# EAGLE schematic ui_board (EAGLE 6.5.0)
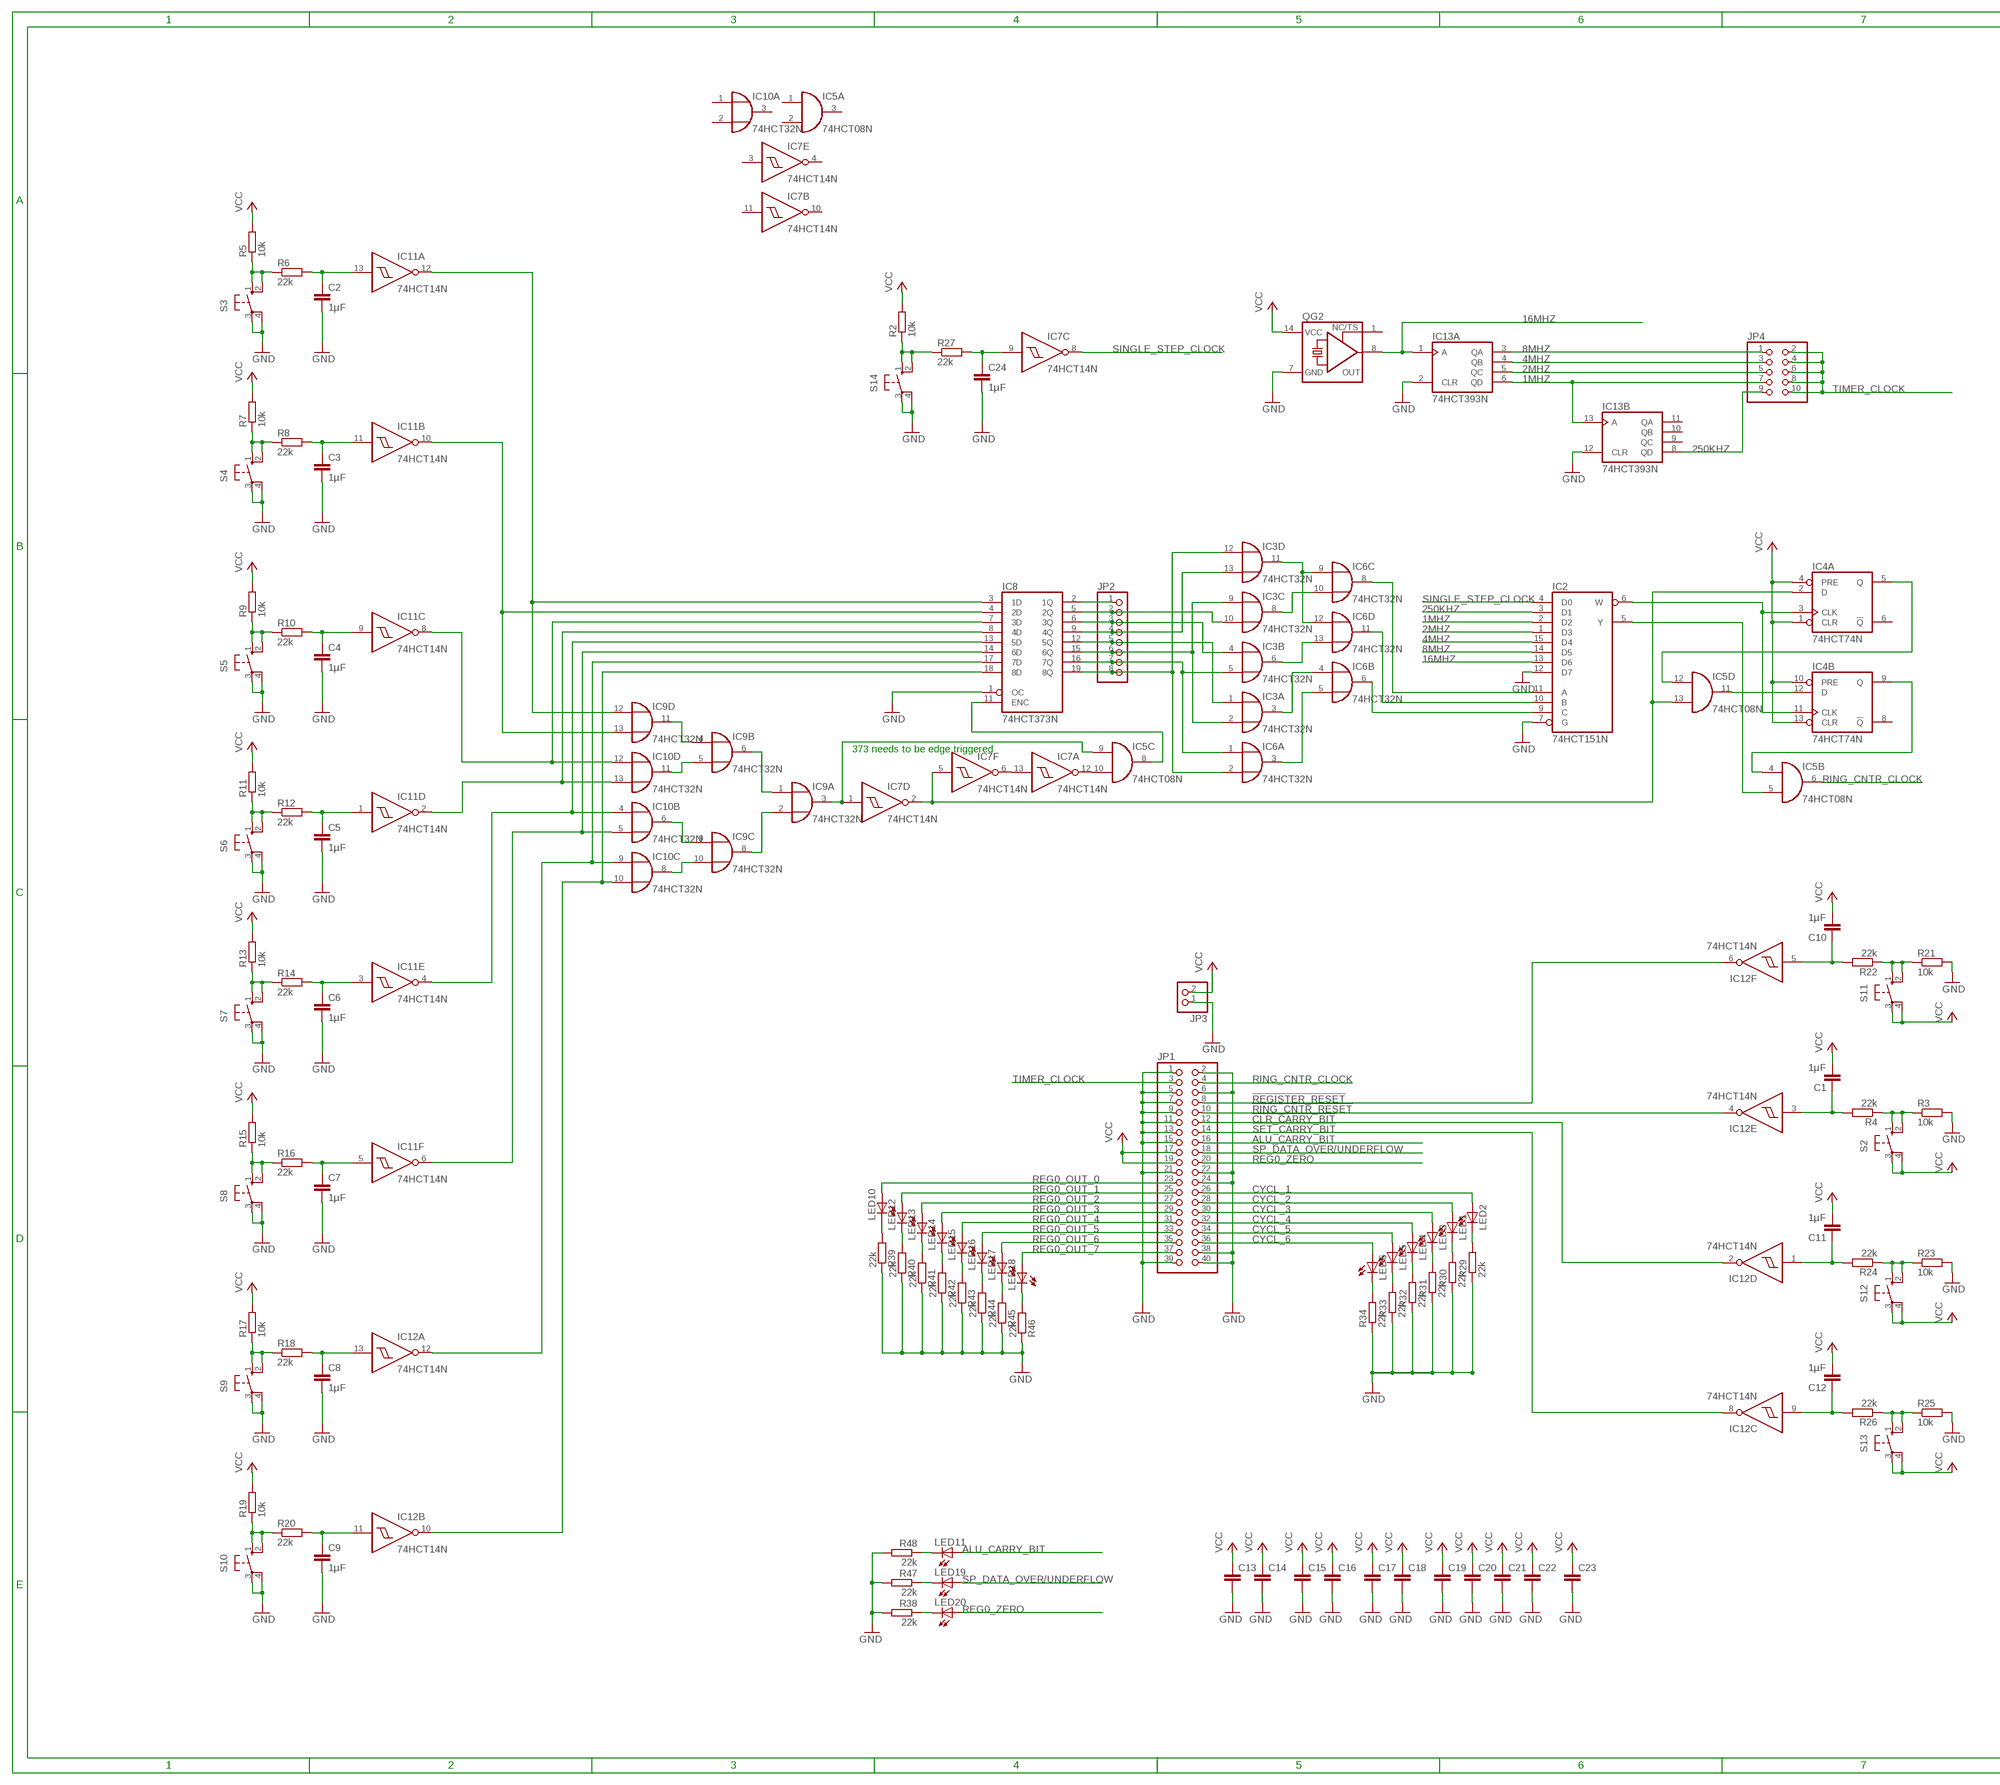
[diagram p0: schematic, sheet 1, part 1 of 2]
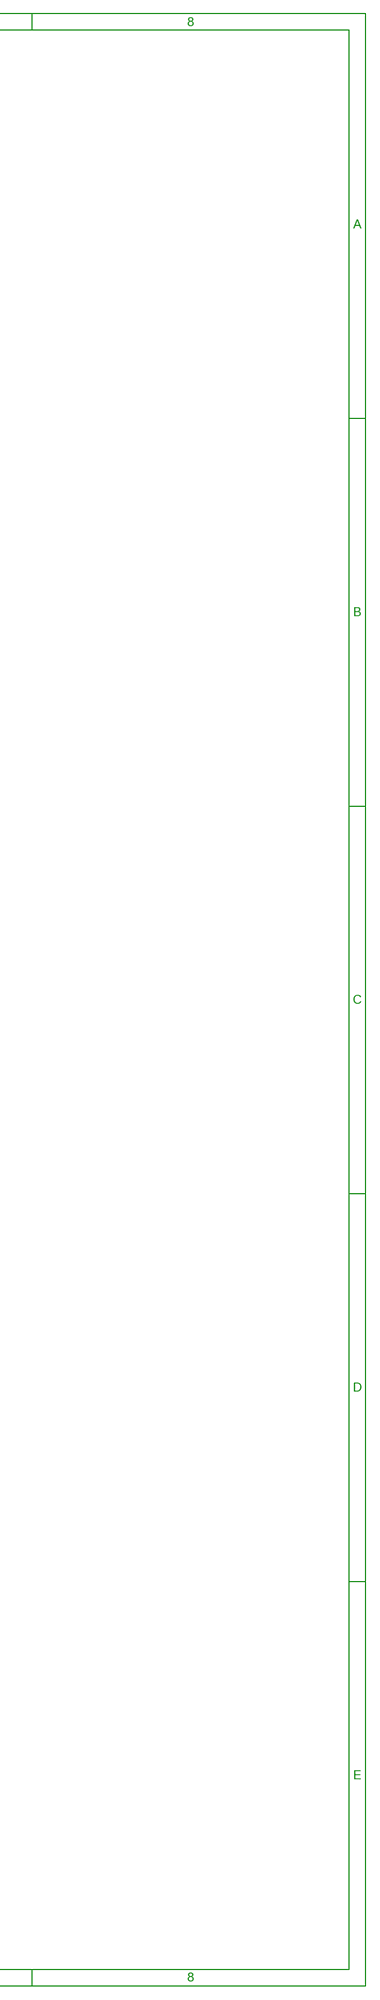
[diagram p1: schematic, sheet 1, part 2 of 2]

## Parts
C1  1µF  C-EU025-024X044  [C025-024X044]
C2  1µF  C-EU025-024X044  [C025-024X044]
C3  1µF  C-EU025-024X044  [C025-024X044]
C4  1µF  C-EU025-024X044  [C025-024X044]
C5  1µF  C-EU025-024X044  [C025-024X044]
C6  1µF  C-EU025-024X044  [C025-024X044]
C7  1µF  C-EU025-024X044  [C025-024X044]
C8  1µF  C-EU025-024X044  [C025-024X044]
C9  1µF  C-EU025-024X044  [C025-024X044]
C10  1µF  C-EU025-024X044  [C025-024X044]
C11  1µF  C-EU025-024X044  [C025-024X044]
C12  1µF  C-EU025-024X044  [C025-024X044]
C13  C-EUC1206  [C1206]
C14  C-EUC1206  [C1206]
C15  C-EUC1206  [C1206]
C16  C-EUC1206  [C1206]
C17  C-EUC1206  [C1206]
C18  C-EUC1206  [C1206]
C19  C-EUC1206  [C1206]
C20  C-EUC1206  [C1206]
C21  C-EUC1206  [C1206]
C22  C-EUC1206  [C1206]
C23  C-EUC1206  [C1206]
C24  1µF  C-EU025-024X044  [C025-024X044]
IC2  74HCT151N  [DIL16]
IC3  74HCT32N  [DIL14]
IC4  74HCT74N  [DIL14]
IC5  74HCT08N  [DIL14]
IC6  74HCT32N  [DIL14]
IC7  74HCT14N  [DIL14]
IC8  74HCT373N  [DIL20]
IC9  74HCT32N  [DIL14]
IC10  74HCT32N  [DIL14]
IC11  74HCT14N  [DIL14]
IC12  74HCT14N  [DIL14]
IC13  74HCT393N  [DIL14]
JP1  PINHD-2X20  [2X20]
JP2  PINHD-1X8  [1X08]
JP3  PINHD-1X2  [1X02]
JP4  PINHD-2X5  [2X05]
LED1  LED3MM  [LED3MM]
LED2  LED3MM  [LED3MM]
LED3  LED3MM  [LED3MM]
LED4  LED3MM  [LED3MM]
LED5  LED3MM  [LED3MM]
LED6  LED3MM  [LED3MM]
LED10  LED3MM  [LED3MM]
LED11  LED3MM  [LED3MM]
LED12  LED3MM  [LED3MM]
LED13  LED3MM  [LED3MM]
LED14  LED3MM  [LED3MM]
LED15  LED3MM  [LED3MM]
LED16  LED3MM  [LED3MM]
LED17  LED3MM  [LED3MM]
LED18  LED3MM  [LED3MM]
LED19  LED3MM  [LED3MM]
LED20  LED3MM  [LED3MM]
QG2  XO-14  [DIL14S]
R2  10k  R-EU_R1206  [R1206]
R3  10k  R-EU_R1206  [R1206]
R4  22k  R-EU_R1206  [R1206]
R5  10k  R-EU_R1206  [R1206]
R6  22k  R-EU_R1206  [R1206]
R7  10k  R-EU_R1206  [R1206]
R8  22k  R-EU_R1206  [R1206]
R9  10k  R-EU_R1206  [R1206]
R10  22k  R-EU_R1206  [R1206]
R11  10k  R-EU_R1206  [R1206]
R12  22k  R-EU_R1206  [R1206]
R13  10k  R-EU_R1206  [R1206]
R14  22k  R-EU_R1206  [R1206]
R15  10k  R-EU_R1206  [R1206]
R16  22k  R-EU_R1206  [R1206]
R17  10k  R-EU_R1206  [R1206]
R18  22k  R-EU_R1206  [R1206]
R19  10k  R-EU_R1206  [R1206]
R20  22k  R-EU_R1206  [R1206]
R21  10k  R-EU_R1206  [R1206]
R22  22k  R-EU_R1206  [R1206]
R23  10k  R-EU_R1206  [R1206]
R24  22k  R-EU_R1206  [R1206]
R25  10k  R-EU_R1206  [R1206]
R26  22k  R-EU_R1206  [R1206]
R27  22k  R-EU_R1206  [R1206]
R29  22k  R-EU_R1206  [R1206]
R30  22k  R-EU_R1206  [R1206]
R31  22k  R-EU_R1206  [R1206]
R32  22k  R-EU_R1206  [R1206]
R33  22k  R-EU_R1206  [R1206]
R34  22k  R-EU_R1206  [R1206]
R38  22k  R-EU_R1206  [R1206]
R39  22k  R-EU_R1206  [R1206]
R40  22k  R-EU_R1206  [R1206]
R41  22k  R-EU_R1206  [R1206]
R42  22k  R-EU_R1206  [R1206]
R43  22k  R-EU_R1206  [R1206]
R44  22k  R-EU_R1206  [R1206]
R45  22k  R-EU_R1206  [R1206]
R46  22k  R-EU_R1206  [R1206]
R47  22k  R-EU_R1206  [R1206]
R48  22k  R-EU_R1206  [R1206]
S2  10-XX  [B3F-10XX]
S3  10-XX  [B3F-10XX]
S4  10-XX  [B3F-10XX]
S5  10-XX  [B3F-10XX]
S6  10-XX  [B3F-10XX]
S7  10-XX  [B3F-10XX]
S8  10-XX  [B3F-10XX]
S9  10-XX  [B3F-10XX]
S10  10-XX  [B3F-10XX]
S11  10-XX  [B3F-10XX]
S12  10-XX  [B3F-10XX]
S13  10-XX  [B3F-10XX]
S14  10-XX  [B3F-10XX]

## Nets
1MHZ: IC2.2(D2) IC13.6(A:QD) IC13.13(B:A) JP4.7
2MHZ: IC2.1(D3) IC13.5(A:QC) JP4.5
4MHZ: IC2.15(D4) IC13.4(A:QB) JP4.3
8MHZ: IC2.14(D5) IC13.3(A:QA) JP4.1
16MHZ: IC2.13(D6) IC13.1(A:A) QG2.8(OUT)
250KHZ: IC2.3(D1) IC13.8(B:QD) JP4.9
!CLR_CARRY_BIT: IC12.2(D:O) JP1.12
!REGISTER_RESET: IC12.6(F:O) JP1.8
!RING_CNTR_RESET: IC12.4(E:O) JP1.10
!SET_CARRY_BIT: IC12.8(C:O) JP1.14
ALU_CARRY_BIT: JP1.16 LED11.A
CHANGE_CLOCK_SELECT: IC5.9(C:I0) IC7.1(D:I) IC9.3(A:O)
CHANGE_CLOCK_SELECT1: IC8.3(1D) IC9.12(D:I0) IC11.12(A:O)
CHANGE_CLOCK_SELECT2: IC8.4(2D) IC9.13(D:I1) IC11.10(B:O)
CHANGE_CLOCK_SELECT3: IC8.7(3D) IC10.12(D:I0) IC11.8(C:O)
CHANGE_CLOCK_SELECT5: IC8.13(5D) IC10.4(B:I0) IC11.4(E:O)
CHANGE_CLOCK_SELECT6: IC8.14(6D) IC10.5(B:I1) IC11.6(F:O)
CHANGE_CLOCK_SELECT7: IC8.17(7D) IC10.9(C:I0) IC12.12(A:O)
CHANGE_CLOCK_SELECT8: IC8.18(8D) IC10.10(C:I1) IC12.10(B:O)
CYCL_1: JP1.26 LED2.A
CYCL_2: JP1.28 LED1.A
CYCL_3: JP1.30 LED3.A
CYCL_4: JP1.32 LED4.A
CYCL_5: JP1.34 LED5.A
CYCL_6: JP1.36 LED6.A
GND: C2.2 C3.2 C4.2 C5.2 C6.2 C7.2 C8.2 C9.2 C13.2 C14.2 C15.2 C16.2 C17.2 C18.2 C19.2 C20.2 C21.2 C22.2 C23.2 C24.2 IC2.7(G) IC2.12(D7) IC8.1(OC) IC13.2(A:CLR) IC13.12(B:CLR) JP1.1 JP1.2 JP1.5 JP1.6 JP1.7 JP1.9 JP1.11 JP1.13 JP1.15 JP1.21 JP1.22 JP1.24 JP1.38 JP1.39 JP1.40 JP3.1 QG2.7(GND) R3.2 R21.2 R23.2 R25.2 R29.1 R30.1 R31.1 R32.1 R33.1 R34.1 R38.2 R39.1 R40.1 R41.1 R42.1 R43.1 R44.1 R45.1 R46.1 R47.2 R48.2 S3.3(P) S3.4(P1) S4.3(P) S4.4(P1) S5.3(P) S5.4(P1) S6.3(P) S6.4(P1) S7.3(P) S7.4(P1) S8.3(P) S8.4(P1) S9.3(P) S9.4(P1) S10.3(P) S10.4(P1) S14.3(P) S14.4(P1)
N$1: IC4.9(B:Q) IC5.4(B:I0)
N$3: R2.1 R27.1 S14.1(S) S14.2(S1)
N$4: IC4.12(B:D) IC5.11(D:O)
N$5: IC2.6(W) IC4.3(A:CLK) IC4.11(B:CLK)
N$6: IC2.10(B) IC6.11(D:O)
N$7: IC8.2(1Q) JP2.1
N$8: IC4.5(A:Q) IC5.12(D:I0)
N$9: IC7.6(F:O) IC7.13(A:I)
N$10: IC4.2(A:D) IC5.13(D:I1) IC7.2(D:O) IC7.5(F:I)
N$11: IC2.11(A) IC6.8(C:O)
N$12: IC3.11(D:O) IC6.9(C:I0) IC6.12(D:I0)
N$13: IC2.9(C) IC6.6(B:O)
N$14: R5.1 R6.1 S3.1(S) S3.2(S1)
N$15: C2.1 IC11.13(A:I) R6.2
N$16: R7.1 R8.1 S4.1(S) S4.2(S1)
N$17: LED20.K(C) R38.1
N$18: IC3.6(B:O) IC6.13(D:I1)
N$19: IC3.10(C:I1) IC8.5(2Q) JP2.2
N$20: R3.1 R4.1 S2.1(S) S2.2(S1)
N$21: IC3.13(D:I1) IC8.9(4Q) JP2.4
N$22: IC3.1(A:I0) IC8.12(5Q) JP2.5
N$23: IC3.2(A:I1) IC3.9(C:I0) IC8.15(6Q) JP2.6
N$24: IC3.5(B:I1) IC6.1(A:I0) IC8.16(7Q) JP2.7
N$25: IC3.12(D:I0) IC6.2(A:I1) IC8.19(8Q) JP2.8
N$26: IC9.5(B:I1) IC10.11(D:O)
N$27: IC9.4(B:I0) IC9.11(D:O)
N$28: IC9.9(C:I0) IC10.6(B:O)
N$29: IC9.10(C:I1) IC10.8(C:O)
N$30: IC9.2(A:I1) IC9.8(C:O)
N$31: IC9.1(A:I0) IC9.6(B:O)
N$32: IC3.8(C:O) IC6.10(C:I1)
N$33: IC3.3(A:O) IC6.4(B:I0)
N$34: IC6.3(A:O) IC6.5(B:I1)
N$35: C3.1 IC11.11(B:I) R8.2
N$36: R9.1 R10.1 S5.1(S) S5.2(S1)
N$37: C4.1 IC11.9(C:I) R10.2
N$38: R11.1 R12.1 S6.1(S) S6.2(S1)
N$39: C5.1 IC11.1(D:I) R12.2
N$40: R13.1 R14.1 S7.1(S) S7.2(S1)
N$41: C6.1 IC11.3(E:I) R14.2
N$42: R15.1 R16.1 S8.1(S) S8.2(S1)
N$43: C7.1 IC11.5(F:I) R16.2
N$44: R17.1 R18.1 S9.1(S) S9.2(S1)
N$45: C8.1 IC12.13(A:I) R18.2
N$46: R19.1 R20.1 S10.1(S) S10.2(S1)
N$47: C9.1 IC12.11(B:I) R20.2
N$48: C1.1 IC12.3(E:I) R4.2
N$49: IC8.8(4D) IC10.13(D:I1) IC11.2(D:O)
N$50: R21.1 R22.1 S11.1(S) S11.2(S1)
N$51: C10.1 IC12.5(F:I) R22.2
N$52: R23.1 R24.1 S12.1(S) S12.2(S1)
N$53: C11.1 IC12.1(D:I) R24.2
N$54: R25.1 R26.1 S13.1(S) S13.2(S1)
N$55: C12.1 IC12.9(C:I) R26.2
N$56: C24.1 IC7.9(C:I) R27.2
N$57: LED10.K(C) R39.2
N$58: LED12.K(C) R40.2
N$59: LED13.K(C) R41.2
N$60: LED2.K(C) R29.2
N$61: LED1.K(C) R30.2
N$62: LED3.K(C) R31.2
N$63: LED4.K(C) R32.2
N$64: LED5.K(C) R33.2
N$65: LED6.K(C) R34.2
N$68: IC5.10(C:I1) IC7.12(A:O)
N$69: LED14.K(C) R42.2
N$70: LED15.K(C) R43.2
N$71: LED16.K(C) R44.2
N$72: LED17.K(C) R45.2
N$73: LED18.K(C) R46.2
N$74: LED19.K(C) R47.1
N$75: LED11.K(C) R48.1
N$76: IC3.4(B:I0) IC8.6(3Q) JP2.3
N$78: IC5.8(C:O) IC8.11(ENC)
REG0_OUT_0: JP1.23 LED10.A
REG0_OUT_1: JP1.25 LED12.A
REG0_OUT_2: JP1.27 LED13.A
REG0_OUT_3: JP1.29 LED14.A
REG0_OUT_4: JP1.31 LED15.A
REG0_OUT_5: JP1.33 LED16.A
REG0_OUT_6: JP1.35 LED17.A
REG0_OUT_7: JP1.37 LED18.A
REG0_ZERO: JP1.20 LED20.A
RING_CNTR_CLOCK: IC5.6(B:O) JP1.4
SELECTED_CLOCK: IC2.5(Y) IC5.5(B:I1)
SINGLE_STEP_CLOCK: IC2.4(D0) IC7.8(C:O)
SP_DATA_OVER/UNDERFLOW: JP1.18 LED19.A
TIMER_CLOCK: JP1.3 JP4.2 JP4.4 JP4.6 JP4.8 JP4.10
VCC: C1.2 C10.2 C11.2 C12.2 C13.1 C14.1 C15.1 C16.1 C17.1 C18.1 C19.1 C20.1 C21.1 C22.1 C23.1 IC4.1(A:CLR) IC4.4(A:PRE) IC4.10(B:PRE) IC4.13(B:CLR) JP1.17 JP1.19 JP3.2 QG2.14(VCC) R2.2 R5.2 R7.2 R9.2 R11.2 R13.2 R15.2 R17.2 R19.2 S2.3(P) S2.4(P1) S11.3(P) S11.4(P1) S12.3(P) S12.4(P1) S13.3(P) S13.4(P1)
Unconnected: IC4.6(A:!Q) IC4.8(B:!Q) IC5.1(A:I0) IC5.2(A:I1) IC5.3(A:O) IC7.3(E:I) IC7.4(E:O) IC7.10(B:O) IC7.11(B:I) IC10.1(A:I0) IC10.2(A:I1) IC10.3(A:O) IC13.9(B:QC) IC13.10(B:QB) IC13.11(B:QA) QG2.1(TS)

## Notes on the sheet
- 373 needs to be edge triggered

## Power pins joined to a net without a drawn wire
GND: IC2.8(GND) IC3.7(P:GND) IC4.7(P:GND) IC5.7(P:GND) IC6.7(P:GND) IC7.7(P:GND) IC8.10(GND) IC9.7(P:GND) IC10.7(P:GND) IC11.7(P:GND) IC12.7(P:GND) IC13.7(P:GND)
VCC: IC2.16(VCC) IC3.14(P:VCC) IC4.14(P:VCC) IC5.14(P:VCC) IC6.14(P:VCC) IC7.14(P:VCC) IC8.20(VCC) IC9.14(P:VCC) IC10.14(P:VCC) IC11.14(P:VCC) IC12.14(P:VCC) IC13.14(P:VCC)

## Library data of the parts
C1-C24 = rcl:C-EU: CAPACITOR, European symbol
IC2 = 74xx-eu:74*151: Data SELECTOR/MULTIPLEXER
IC3 IC6 IC9 IC10 = 74xx-eu:74*32: Quad 2-input OR gate
IC4 = 74xx-eu:74*74: Dual D type positive edge triggered FLIP FLOP, preset and clear
IC5 = 74xx-eu:74*08: Quad 2-input AND gate
IC7 IC11 IC12 = 74xx-eu:74*14: Hex schmitt trigger INVERTER
IC8 = 74xx-eu:74*373: Octal D type transparent LATCH, edge triggered
IC13 = 74xx-eu:74*393: Dual 4-bit decade and binary COUNTER
JP1 = pinhead:PINHD-2X20: PIN HEADER
JP2 = pinhead:PINHD-1X8: PIN HEADER
JP3 = pinhead:PINHD-1X2: PIN HEADER
JP4 = pinhead:PINHD-2X5: PIN HEADER
LED1-LED6 LED10-LED20 = led:LED: LED OSRAM: - CHIPLED LG R971, LG N971, LY N971, LG Q971, LY Q971, LO R971, LY R971 LH N974, LH R974 LS Q976, LO Q976, LY Q976 LO Q996 - Hyper CHIPLED LW Q18S LB Q993, LB Q99A, LB R99A - SideLED LS A670, LO A670, LY A670, LG A670, LP A670 LB A673, LV A673, LT A673, LW A673 LH A674 LY A675 LS A676, LA A676, LO A676, LY A676, LW A676 LS A679, LY A679, LG A679 - Hyper Micro SIDELED® LS Y876, LA Y876, LO Y876, LY Y876 LT Y87S - SmartLED LW L88C, LW L88S LB L89C, LB L89S, LG L890 LS L89K, LO L89K, LY L89K LS L896, LA L896, LO L896, LY L896 - TOPLED LS T670, LO T670, LY T670, LG T670, LP T670 LSG T670, LSP T670, LSY T670, LOP T670, LYG T670 LG T671, LOG T671, LSG T671 LB T673, LV T673, LT T673, LW T673 LH T674 LS T676, LA T676, LO T676, LY T676, LB T676, LH T676, LSB T676, LW T676 LB T67C, LV T67C, LT T67C, LS T67K, LO T67K, LY T67K, LW E67C LS E67B, LA E67B, LO E67B, LY E67B, LB E67C, LV E67C, LT E67C LW T67C LS T679, LY T679, LG T679 LS T770, LO T770, LY T770, LG T770, LP T770 LB T773, LV T773, LT T773, LW T773 LH T774 LS E675, LA E675, LY E675, LS T675 LS T776, LA T776, LO T776, LY T776, LB T776 LHGB T686 LT T68C, LB T68C - Hyper Mini TOPLED® LB M676 - Mini TOPLED Santana® LG M470 LS M47K, LO M47K, LY M47K Source: http://www.osram.convergy.de LUXEON: - LUMILED® LXK2-PW12-R00, LXK2-PW12-S00, LXK2-PW14-U00, LXK2-PW14-V00 LXK2-PM12-R00, LXK2-PM12-S00, LXK2-PM14-U00 LXK2-PE12-Q00, LXK2-PE12-R00, LXK2-PE12-S00, LXK2-PE14-T00, LXK2-PE14-U00 LXK2-PB12-K00, LXK2-PB12-L00, LXK2-PB12-M00, LXK2-PB14-N00, LXK2-PB14-P00, LXK2-PB14-Q00 LXK2-PR12-L00, LXK2-PR12-M00, LXK2-PR14-Q00, LXK2-PR14-R00 LXK2-PD12-Q00, LXK2-PD12-R00, LXK2-PD12-S00 LXK2-PH12-R00, LXK2-PH12-S00 LXK2-PL12-P00, LXK2-PL12-Q00, LXK2-PL12-R00 Source: www.luxeon.com KINGBRIGHT: KA-3528ASYC Source: www.kingbright.com
QG2 = crystal:XO-: CRYSTAL; OC_FARNELL: unknown; OC_NEWARK: unknown
R2-R27 R29-R34 R38-R48 = rcl:R-EU_: RESISTOR, European symbol
S2-S14 = switch-omron:10-XX: OMRON SWITCH; MPN: B3F-1000; OC_FARNELL: 176432; OC_NEWARK: 36M3542